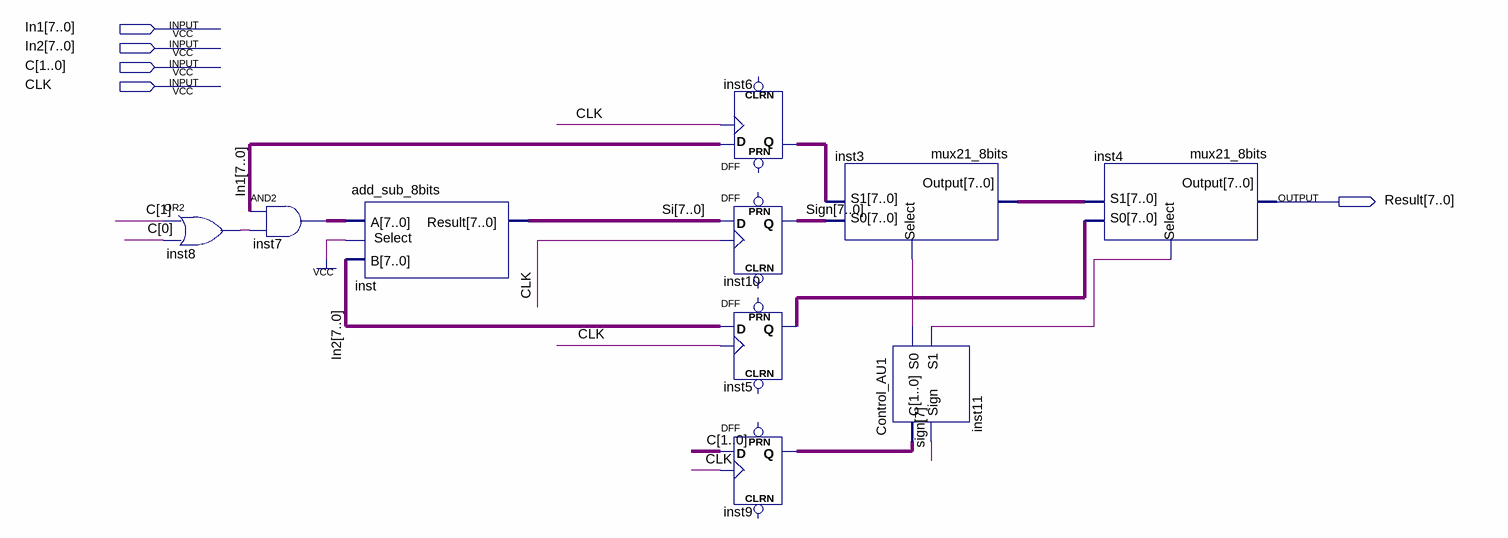
[diagram p0: schematic sheet]
// Quartus schematic AU1_2state.bdf as structural Verilog: 10 symbols, 5 pins
module AU1_2state (
  input  [7:0] In1,
  input  [7:0] In2,
  input  [1:0] C,
  input  CLK,
  output [7:0] Result
);

  wire inst8_out, inst11_s0, inst11_s1;
  wire [1:0] inst9_q;
  wire [7:0] inst3_output, inst5_q, inst6_q, inst7_out, Si, sign;

  or inst8 (inst8_out, C[1], C[0]);
  assign inst7_out = In1 & {8{inst8_out}};  // AND2 inst7, 8 bits wide
  add_sub_8bits inst (.Select(1'b1), .A(inst7_out), .B(In2), .Result(Si));
  DFF inst6[7:0] (.CLK(CLK), .D(In1), .Q(inst6_q));  // open: CLRN, PRN
  DFF inst10[7:0] (.CLK(CLK), .D(Si), .Q(sign));  // open: CLRN, PRN
  DFF inst5[7:0] (.CLK(CLK), .D(In2), .Q(inst5_q));  // open: CLRN, PRN
  DFF inst9[1:0] (.CLK(CLK), .D(C), .Q(inst9_q));  // open: CLRN, PRN
  mux21_8bits inst3 (.S0(sign), .S1(inst6_q), .Select(inst11_s0), .Output(inst3_output));
  Control_AU1 inst11 (.C(inst9_q), .Sign(sign[7]), .S0(inst11_s0), .S1(inst11_s1));
  mux21_8bits inst4 (.S0(inst5_q), .S1(inst3_output), .Select(inst11_s1), .Output(Result));
endmodule
